# Altium schematic sheet Peripherals.SchDoc
size A3; Author: Ali Zoubir; Organization: ETML-ES; Address1: Avenue Recordon 1; Address2: 1004 Lausanne; Address3: Switzerland; Revision: 2221; SheetNumber: 5; SheetTotal: 6; Version: V0
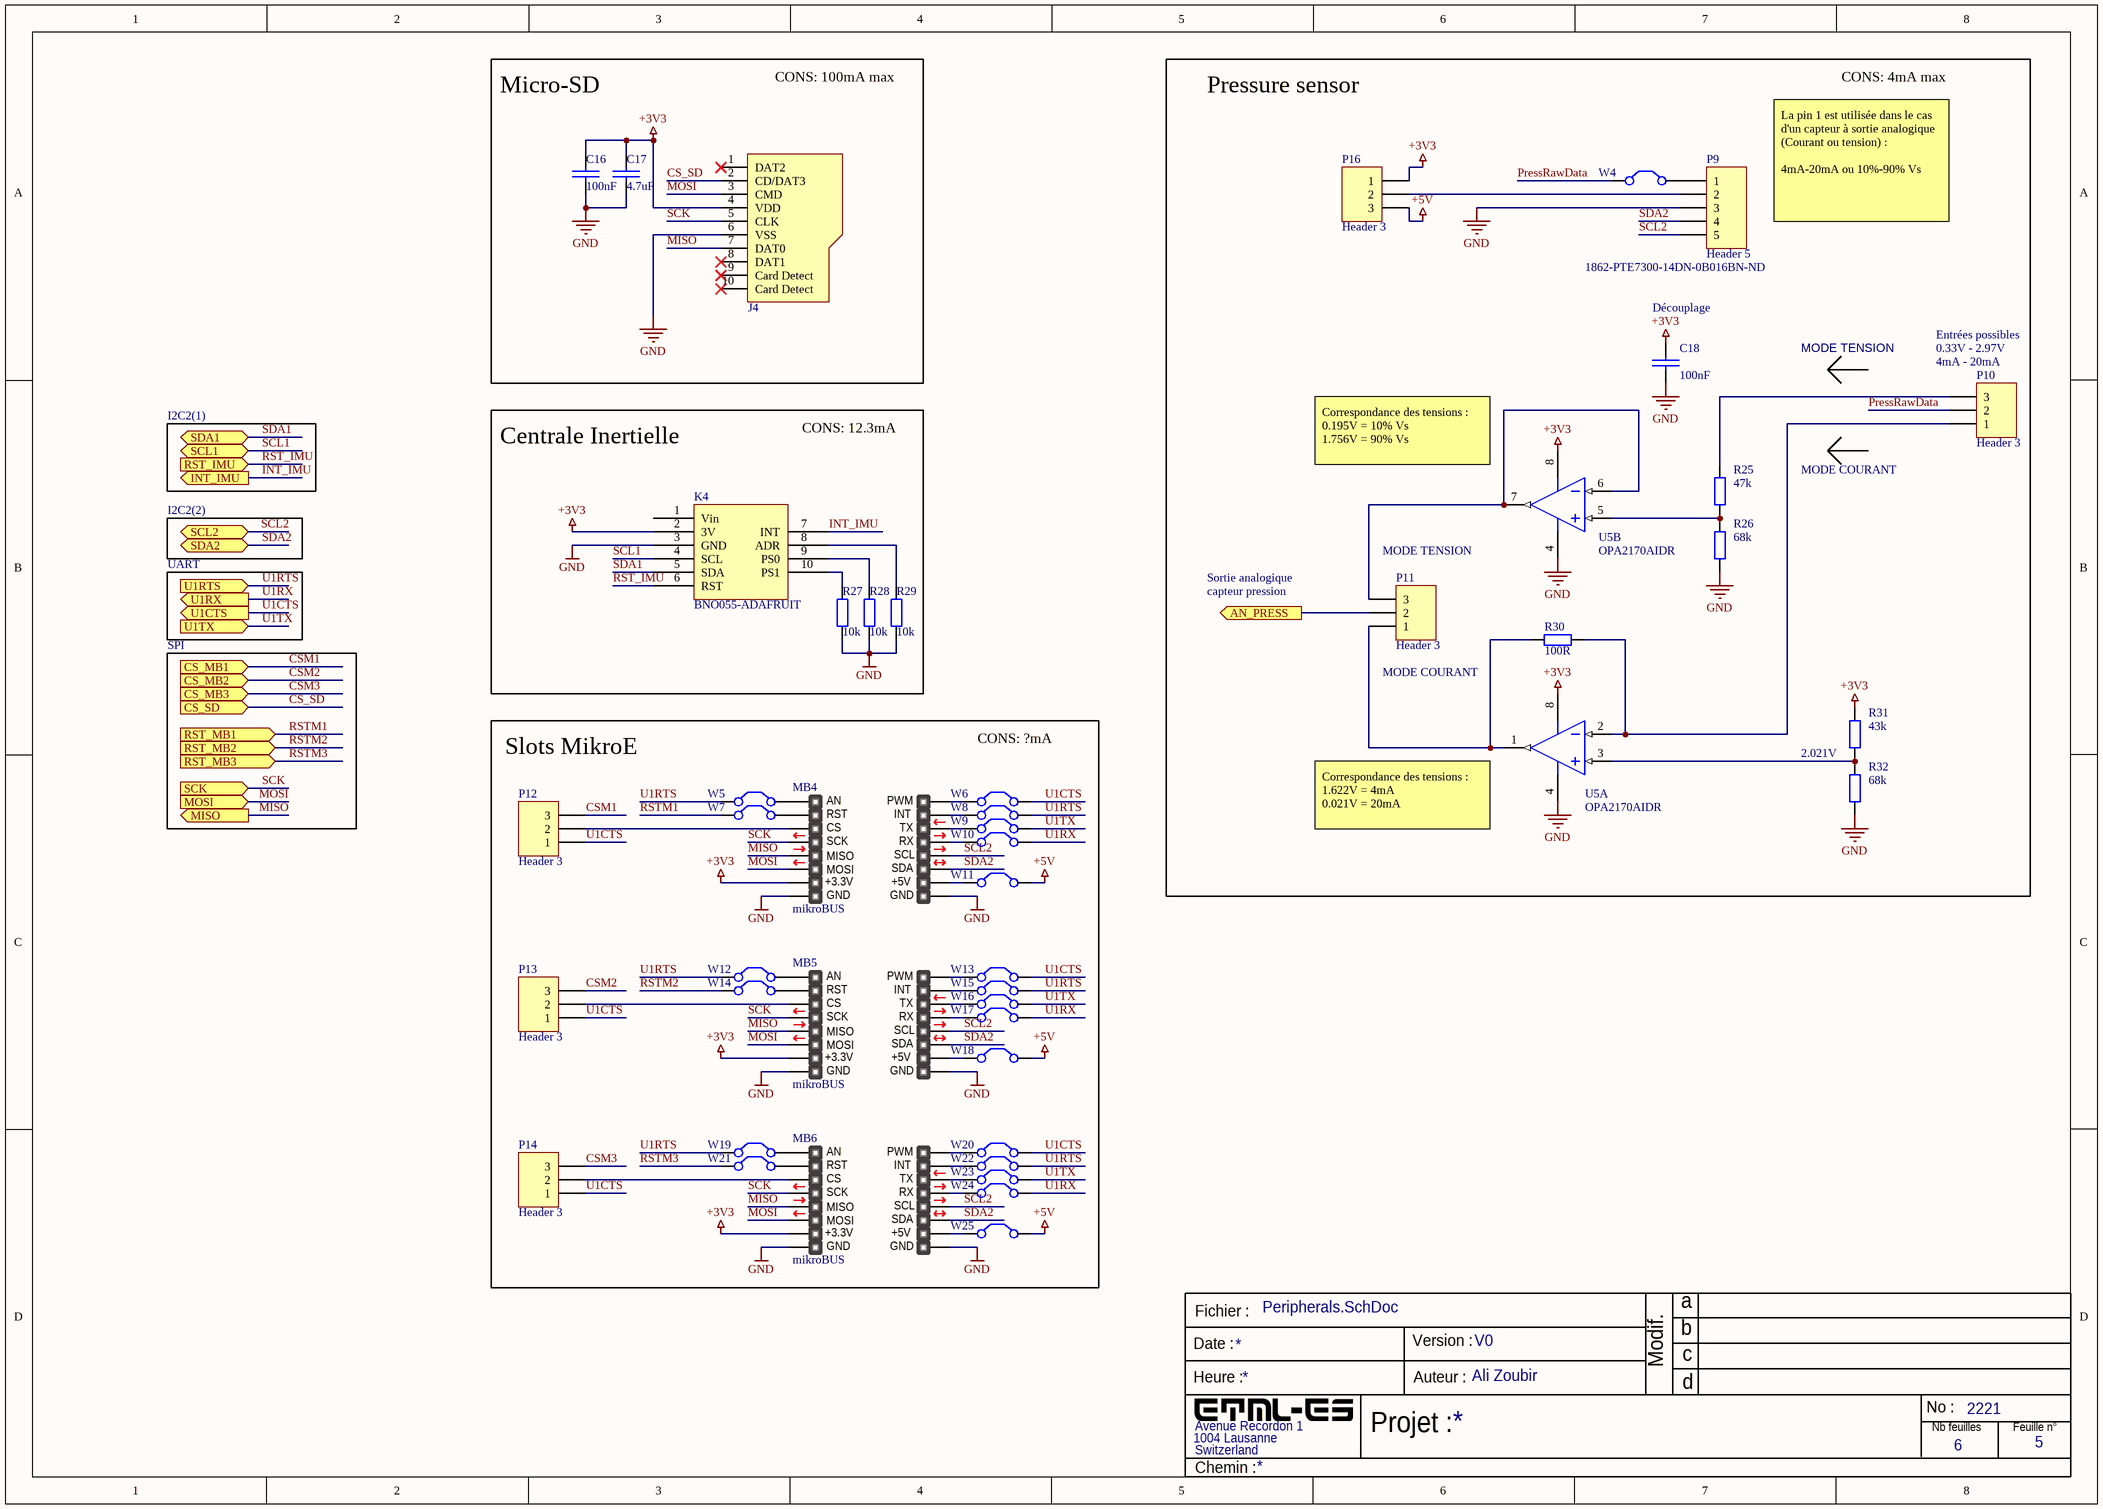
[diagram p0: Peripherals.SchDoc]

## Parts
C16  100nF  [6-0805_L]
C17  4.7uF  [6-0805_L]
C18  100nF  [6-0805_L]
J4  693071010811  [uSD-WE-693071010811]  (value not drawn)
K4  BNO055-ADAFRUIT  [BNO055-ADAFRUIT]
MB4  mikroBUS  [mikroBUS - Large]  (no BOM)
MB5  mikroBUS  [mikroBUS - Large]  (no BOM)
MB6  mikroBUS  [mikroBUS - Large]  (no BOM)
P9  Header 5  Supplier Part Number 1: 1862-PTE7300-14DN-0B016BN-ND  [HDR1X5]
P10  Header 3  [HDR1X3]
P11  Header 3  [HDR1X3]
P12  Header 3  [HDR1X3]
P13  Header 3  [HDR1X3]
P14  Header 3  [HDR1X3]
P16  Header 3  [HDR1X3]
R25  47k  [6-0805_L]
R26  68k  [6-0805_L]
R27  10k  [6-0805_L]
R28  10k  [6-0805_L]
R29  10k  [6-0805_L]
R30  100R  [6-0805_L]
R31  43k  [6-0805_L]
R32  68k  [6-0805_L]
U5  OPA2170AIDR  [D0008A_M]  (parts A,B of 2)
W4  Jumper  [JUMPER]  (value not drawn)
W5  Jumper  [JUMPER]  (value not drawn)
W6  Jumper  [JUMPER]  (value not drawn)
W7  Jumper  [JUMPER]  (value not drawn)
W8  Jumper  [JUMPER]  (value not drawn)
W9  Jumper  [JUMPER]  (value not drawn)
W10  Jumper  [JUMPER]  (value not drawn)
W11  Jumper  [JUMPER]  (value not drawn)
W12  Jumper  [JUMPER]  (value not drawn)
W13  Jumper  [JUMPER]  (value not drawn)
W14  Jumper  [JUMPER]  (value not drawn)
W15  Jumper  [JUMPER]  (value not drawn)
W16  Jumper  [JUMPER]  (value not drawn)
W17  Jumper  [JUMPER]  (value not drawn)
W18  Jumper  [JUMPER]  (value not drawn)
W19  Jumper  [JUMPER]  (value not drawn)
W20  Jumper  [JUMPER]  (value not drawn)
W21  Jumper  [JUMPER]  (value not drawn)
W22  Jumper  [JUMPER]  (value not drawn)
W23  Jumper  [JUMPER]  (value not drawn)
W24  Jumper  [JUMPER]  (value not drawn)
W25  Jumper  [JUMPER]  (value not drawn)

## Blocks framed on the sheet
Micro-SD: C16 C17 J4
Pressure sensor: C18 P9-P11 P16 R25 R26 R30-R32 U5 W4
Centrale Inertielle: K4 R27-R29
Slots MikroE: MB4-MB6 P12-P14 W5-W25

## Ports
AN_PRESS (out), CS_MB1 (in), CS_MB2 (in), CS_MB3 (in), CS_SD (in), INT_IMU (out), MISO (out), MOSI (in), RST_IMU (in), RST_MB1 (in), RST_MB2 (in), RST_MB3 (in), SCK (in), SCL1 (bidir), SCL2 (bidir), SDA1 (bidir), SDA2 (bidir), U1CTS (out), U1RTS (in), U1RX (out), U1TX (in)

## Nets
+3V3: C16.1 C17.1 C18.1 J4.4(VDD) K4.2(3V) MB4.7(3.3V) MB5.7(3.3V) MB6.7(3.3V) P16.1 R31.2 U5.8(V+)
+5V: P16.3 W11.2(C2) W18.2(C2) W25.2(C2)
GND: C16.2 C17.2 C18.2 J4.6(VSS) K4.3(GND) MB4.8(GND) MB4.9(GND) MB5.8(GND) MB5.9(GND) MB6.8(GND) MB6.9(GND) P9.3 R26.1 R27.1 R28.1 R29.1 R32.1 U5.4(V-)
AN_PRESS: P11.2 ; port AN_PRESS
CS_SD: J4.2(CD/DAT3) ; port CS_SD
CSM1: P12.3 ; port CS_MB1
CSM2: P13.3 ; port CS_MB2
CSM3: P14.3 ; port CS_MB3
INT_IMU: K4.7(INT) ; port INT_IMU
MISO: J4.7(DAT0) MB4.5(MISO) MB5.5(MISO) MB6.5(MISO) ; port MISO
MOSI: J4.3(CMD) MB4.6(MOSI) MB5.6(MOSI) MB6.6(MOSI) ; port MOSI
PressRawData: P10.2 W4.1(C1)
RST_IMU: K4.6(RST) ; port RST_IMU
RSTM1: W7.1(C1) ; port RST_MB1
RSTM2: W14.1(C1) ; port RST_MB2
RSTM3: W21.1(C1) ; port RST_MB3
SCK: J4.5(CLK) MB4.4(SCK) MB5.4(SCK) MB6.4(SCK) ; port SCK
SCL1: K4.4(SCL) ; port SCL1
SCL2: MB4.12(SCL) MB5.12(SCL) MB6.12(SCL) P9.5 ; port SCL2
SDA1: K4.5(SDA) ; port SDA1
SDA2: MB4.11(SDA) MB5.11(SDA) MB6.11(SDA) P9.4 ; port SDA2
U1CTS: P12.1 P13.1 P14.1 W6.2(C2) W13.2(C2) W20.2(C2) ; port U1CTS
U1RTS: W5.1(C1) W8.2(C2) W12.1(C1) W15.2(C2) W19.1(C1) W22.2(C2) ; port U1RTS
U1RX: W10.2(C2) W17.2(C2) W24.2(C2) ; port U1RX
U1TX: W9.2(C2) W16.2(C2) W23.2(C2) ; port U1TX
NetK4_8: K4.8(ADR) R29.2
NetK4_9: K4.9(PS0) R28.2
NetK4_10: K4.10(PS1) R27.2
NetMB4_1: MB4.1(AN) W5.2(C2)
NetMB4_2: MB4.2(RST) W7.2(C2)
NetMB4_3: MB4.3(CS) P12.2
NetMB4_10: MB4.10(5V) W11.1(C1)
NetMB4_13: MB4.13(TX) W10.1(C1)
NetMB4_14: MB4.14(RX) W9.1(C1)
NetMB4_15: MB4.15(INT) W8.1(C1)
NetMB4_16: MB4.16(PWM) W6.1(C1)
NetMB5_1: MB5.1(AN) W12.2(C2)
NetMB5_2: MB5.2(RST) W14.2(C2)
NetMB5_3: MB5.3(CS) P13.2
NetMB5_10: MB5.10(5V) W18.1(C1)
NetMB5_13: MB5.13(TX) W17.1(C1)
NetMB5_14: MB5.14(RX) W16.1(C1)
NetMB5_15: MB5.15(INT) W15.1(C1)
NetMB5_16: MB5.16(PWM) W13.1(C1)
NetMB6_1: MB6.1(AN) W19.2(C2)
NetMB6_2: MB6.2(RST) W21.2(C2)
NetMB6_3: MB6.3(CS) P14.2
NetMB6_10: MB6.10(5V) W25.1(C1)
NetMB6_13: MB6.13(TX) W24.1(C1)
NetMB6_14: MB6.14(RX) W23.1(C1)
NetMB6_15: MB6.15(INT) W22.1(C1)
NetMB6_16: MB6.16(PWM) W20.1(C1)
NetP9_1: P9.1 W4.2(C2)
NetP9_2: P9.2 P16.2
NetP10_1: P10.1 R30.1 U5.2(IN_A-)
NetP10_3: P10.3 R25.2
NetP11_1: P11.1 R30.2 U5.1(OUT_A)
NetP11_3: P11.3 U5.6(IN_B-) U5.7(OUT_B)
NetR25_1: R25.1 R26.2 U5.5(IN_B+)
NetR31_1: R31.1 R32.2 U5.3(IN_A+)

Not connected (* = marked no-connect by the designer): J4 1(DAT2)* 8(DAT1)* 9(Card_Detect)* 10(Card_Detect)*; K4 1(Vin)

## Notes on the sheet
- CONS: 100mA max
- CONS: 4mA max
- La pin 1 est utilisée dans le cas d'un capteur à sortie analogique (Courant ou tension) :
  4mA-20mA ou 10%-90% Vs
- (near C18) Découplage
- MODE TENSION
- (near P10) 0.33V - 2.97V
- (near P10) 4mA - 20mA
- Entrées possibles
- I2C2(1)
- CONS: 12.3mA
- I2C2(2)
- (near U5) Correspondance des tensions :
  0.195V = 10% Vs
  1.756V = 90% Vs
- MODE COURANT
- UART
- Sortie analogique
- (near P11) MODE TENSION
- SPI
- capteur pression
- (near P11) MODE COURANT
- CONS: ?mA
- 2.021V
- (near U5) Correspondance des tensions :
  1.622V = 4mA
  0.021V = 20mA
- Fichier :
- a
- Date :
- Heure :
- Version :
- Auteur :
- Modif.
- b
- c
- d
- Projet :
- No :
- Nb feuilles
- Feuille n°
- Chemin :
- (in symbol mikroBUS compatible add-on board) +3.3V; +5V

## Library data of the parts
C16-C18 = C: SDTSourceLibName: C:\WINDOWS\TEMP\DA.LIB; PCB Footprint: RC0805
J4 = uSD-WE-693071010811: WR-CRD Micro SD Card Connector Push & Push; Manufacturer: Wurth Elektronik; Contact Resistance: 100mOhm; Gender: Socket; Rated Current: 0.5A; Working Voltage: 100VAC; Withstanding Voltage: 500VAC; Manufacturer Part Number: 693071010811; Category: Input/Output Connectors; Match Code: WR-CRD; ComponentLink1Description: Website Link; ComponentLink1URL: https://www.we-online.com/redexpert/article/693071010811?ad; ComponentLink2Description: Datasheet Link; ComponentLink2URL: https://www.we-online.com/redexpert/spec/693071010811?ad; Mount: Surface Mount; Operating Temperature Max: 85°C; Operating Temperature Min: -25°C; Packaging: Tape and Reel; Number of Pins: 8; Type: Push & Push
MB4-MB6 = mikroBUS compatible add-on board
P9 = Header 5: Header, 5-Pin; LatestRevisionDate: 17-Jul-2002; LatestRevisionNote: Re-released for DXP Platform.; Publisher: Altium Limited; Supplier 1: Digi-Key
P10-P14 P16 = Header 3: Header, 3-Pin; LatestRevisionDate: 17-Jul-2002; LatestRevisionNote: Re-released for DXP Platform.; Publisher: Altium Limited
R25-R32 = Res2: Res 0805; Published: 8-Jun-2000; LatestRevisionDate: 17-Jul-2002; LatestRevisionNote: Re-released for DXP Platform.; PackageReference: AXIAL-0.4; Publisher: Altium Limited; PackageDescription: Axial Device, Thru-Hole; 2 Leads; 0.4 in Pin Spacing
  R25: Value: 47k
  R26 R32: Value: 68k
  R27-R29: Value: 10k
  R30: Value: 100R
  R31: Value: 43k
U5 = CMP-0272-00236-3: MicroPower, Rail-to-Rail Output, Dual, General Purpose Operational Amplifier, 2.7 to 36 V, -40 to 125 degC, 8-pin SOIC (D8), Green (RoHS & no Sb/Br); Manufacturer: Texas Instruments; Sub Family: High Supply Voltage Amplifier (>=30V), Low Power Amp (<=500uA), Low Supply Voltage Amplifier (<=2.7V), Precision Amplifier; CMRR(Min)(dB): 104; Slew Rate(Typ)(V/us): 0.4; GBW(Typ)(MHz): 1.2; Rating: Catalog; Offset Drift(Typ)(uV/C): 0.3; Packing: LARGE T&R; Number of Channels: 2; Total Supply Voltage(Min)(+5V is 5, +/-5V is 10): 2.7; Iq per channel(Max)(mA): 0.145; Total Supply Voltage(Max)(+5V is 5, +/-5V is 10): 36; Vio (25C)(Max)(mV): 1.8; IIB(Max)(pA): 15; ComponentLink3URL: http://www.ti.com/litv/pdf/msoi002j; Mounting Technology: Surface Mount; DatasheetVersion: SBOS557B; PartNumber: OPA2170AIDR; ComponentLink1Description: Manufacturer URL; ComponentLink1URL: http://www.ti.com/; Eco-Plan: Green (RoHS & no Sb/Br); ComponentLink2Description: Datasheet; PackageDescription: 8-Pin Plastic Small Outline, Body 4.9 x 3.9 mm, Pitch 1.27 mm; ComponentLink3Description: Package Specification; Code_JEDEC: MS-012; PackageVersion: 4040047-3/M, 06/2011; ComponentLink2URL: http://www.ti.com/lit/ds/symlink/opa2170.pdf; PackageReference: D0008A
W4-W25 = Jumper: Jumper Wire; Published: 24-Mar-1999; LatestRevisionDate: 17-Jul-2002; LatestRevisionNote: Re-released for DXP Platform.; PackageReference: RAD-0.2; Publisher: Altium Limited; PackageDescription: Radial Cap, Thru-Hole; 2 Leads; 0.2 in Pin Spacing